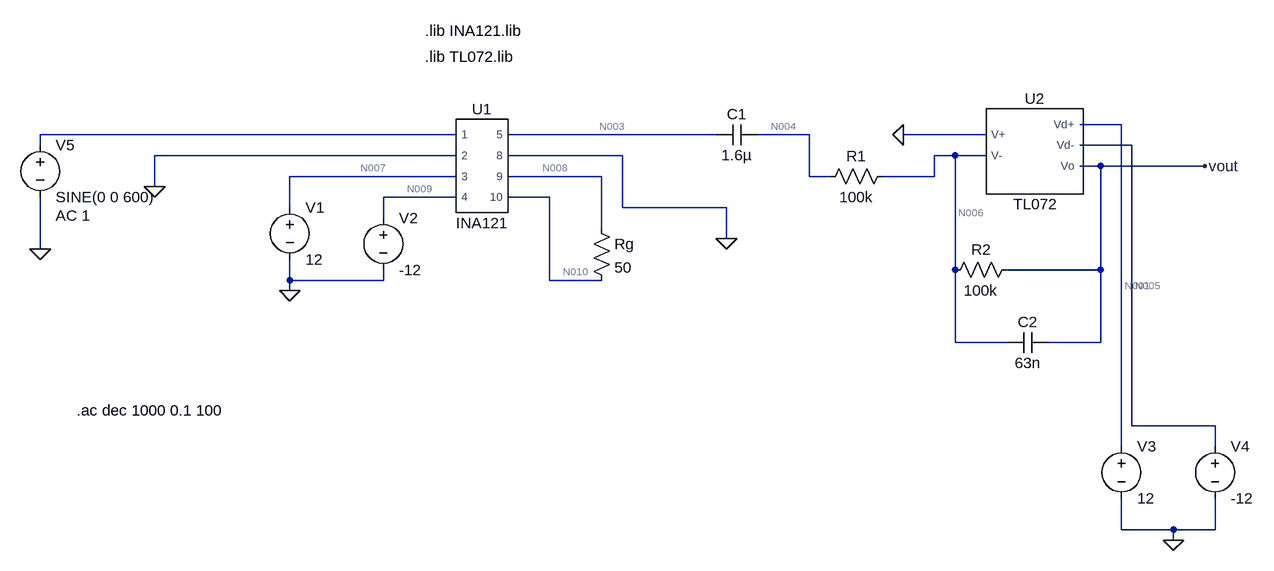
[diagram p0: schematic amp_stage_3.asc]
amp_stage_3.asc, the LTspice schematic file:
Version 4.1
SHEET 1 2028 900
WIRE 1200 160 1136 160
WIRE 176 176 -464 176
WIRE 576 176 256 176
WIRE 720 176 640 176
WIRE 992 176 864 176
WIRE -464 192 -464 176
WIRE 1216 192 1136 192
WIRE 176 208 -288 208
WIRE 432 208 256 208
WIRE 944 208 912 208
WIRE 992 208 944 208
WIRE 1168 224 1136 224
WIRE 1328 224 1168 224
WIRE 176 240 -80 240
WIRE 400 240 256 240
WIRE 720 240 720 176
WIRE 752 240 720 240
WIRE 912 240 912 208
WIRE 912 240 832 240
WIRE -288 256 -288 208
WIRE 176 272 64 272
WIRE 320 272 256 272
WIRE -80 288 -80 240
WIRE 432 288 432 208
WIRE 592 288 432 288
WIRE 64 304 64 272
WIRE 400 320 400 240
WIRE 592 336 592 288
WIRE -464 352 -464 272
WIRE 944 384 944 208
WIRE 1168 384 1168 224
WIRE 1168 384 1024 384
WIRE -80 400 -80 368
WIRE 64 400 64 384
WIRE 64 400 -80 400
WIRE 320 400 320 272
WIRE 400 400 320 400
WIRE -80 416 -80 400
WIRE 944 496 944 384
WIRE 1024 496 944 496
WIRE 1168 496 1168 384
WIRE 1168 496 1088 496
WIRE 1216 624 1216 192
WIRE 1344 624 1216 624
WIRE 1200 656 1200 160
WIRE 1344 656 1344 624
WIRE 1200 784 1200 736
WIRE 1280 784 1200 784
WIRE 1344 784 1344 736
WIRE 1344 784 1280 784
WIRE 1280 800 1280 784
FLAG -80 416 0
FLAG 1280 800 0
FLAG -288 256 0
FLAG -464 352 0
FLAG 592 336 0
FLAG 864 176 0
FLAG 1328 224 vout
SYMBOL INA121 208 224 R0
SYMATTR InstName U1
SYMBOL TL072 1024 192 R0
SYMATTR InstName U2
SYMBOL voltage -80 272 R0
WINDOW 123 0 0 Left 0
WINDOW 39 0 0 Left 0
SYMATTR InstName V1
SYMATTR Value 12
SYMBOL voltage 64 288 R0
WINDOW 123 0 0 Left 0
WINDOW 39 0 0 Left 0
SYMATTR InstName V2
SYMATTR Value -12
SYMBOL res 384 304 R0
SYMATTR InstName Rg
SYMATTR Value 50
SYMBOL voltage 1200 640 R0
WINDOW 123 0 0 Left 0
WINDOW 39 0 0 Left 0
SYMATTR InstName V3
SYMATTR Value 12
SYMBOL voltage 1344 640 R0
WINDOW 123 0 0 Left 0
WINDOW 39 0 0 Left 0
SYMATTR InstName V4
SYMATTR Value -12
SYMBOL voltage -464 176 R0
WINDOW 123 24 124 Left 2
WINDOW 39 0 0 Left 0
SYMATTR Value2 AC 1
SYMATTR InstName V5
SYMATTR Value SINE(0 0 600)
SYMBOL res 1040 368 R90
WINDOW 0 0 56 VBottom 2
WINDOW 3 32 56 VTop 2
SYMATTR InstName R2
SYMATTR Value 100k
SYMBOL cap 1088 480 R90
WINDOW 0 0 32 VBottom 2
WINDOW 3 32 32 VTop 2
SYMATTR InstName C2
SYMATTR Value 63n
SYMBOL res 848 224 R90
WINDOW 0 0 56 VBottom 2
WINDOW 3 32 56 VTop 2
SYMATTR InstName R1
SYMATTR Value 100k
SYMBOL cap 640 160 R90
WINDOW 0 0 32 VBottom 2
WINDOW 3 32 32 VTop 2
SYMATTR InstName C1
SYMATTR Value 1.6µ
TEXT 128 16 Left 2 !.lib INA121.lib
TEXT 128 56 Left 2 !.lib TL072.lib
TEXT -408 600 Left 2 !.ac dec 1000 0.1 100

The netlist it stands for:
* amp_stage_3.asc
X§U1 N002 0 N007 N009 N003 0 N008 N010 INA121  ; pins 1 2 3 4 5 8 9 10
X§U2 0 N006 N001 N005 vout TL072  ; pins V+ V- Vd+ Vd- Vo
V1 N007 0 12
V2 N009 0 -12
Rg N008 N010 50
V3 N001 0 12
V4 N005 0 -12
V5 N002 0 SINE(0 0 600) AC 1
R2 vout N006 100k
C2 vout N006 63n
R1 N006 N004 100k
C1 N004 N003 1.6µ
.lib INA121.lib
.lib TL072.lib
.ac dec 1000 0.1 100
.lib C:\Users\emanu\Documents\PROGETTI\PSP-PlantSignalProcessing\Hardware\biopotential\simulation\INA121.lib
.lib C:\Users\emanu\Documents\POLITO\PROGETTI\PSP-PlantSignalProcessing\biopotential\simulation\TL072.lib
.backanno
.end

* Results of the author's LTspice run, read from the files saved beside the schematic
* Operating Point, zero values left out:
*   V(n007) = 12 V
*   V(n003) = -64.53 mV
*   V(n008) = -1.401 V
*   V(n006) = 10.97 µV
*   V(vout) = 15.11 µV
*   V(n009) = -12 V
*   V(n010) = -1.401 V
*   V(n001) = 12 V
*   V(n005) = -12 V
*   V(n004) = 11.03 µV
*   I(V1) = -441.8 µA
*   I(V5) = 10 pA
*   I(Rg) = 1.288 µA
*   I(V4) = 11.39 mA
*   I(R2) = 41.39 pA
*   I(V2) = 458.6 µA
*   I(V3) = -11.39 mA
*   Ix(u2:1) = 42.05 pA
*   Ix(u2:2) = 42.05 pA
*   Ix(u2:3) = 11.39 mA
*   Ix(u2:4) = -11.39 mA
*   Ix(u2:5) = -41.42 pA
*   Ix(u1:1) = -10 pA
*   Ix(u1:2) = -10 pA
*   Ix(u1:3) = 441.8 µA
*   Ix(u1:4) = -458.6 µA
*   Ix(u1:8) = 17.92 µA
*   Ix(u1:9) = -1.288 µA
*   Ix(u1:10) = 1.288 µA